# EAGLE schematic ElectronicLoad (EAGLE 9.5.1)
DESIGNER: Ailee Simpson; PART_NUMBER: 68-0015; PROJECT: Electronic Load; REV: 1.0.3

## Sheet 1 of 5
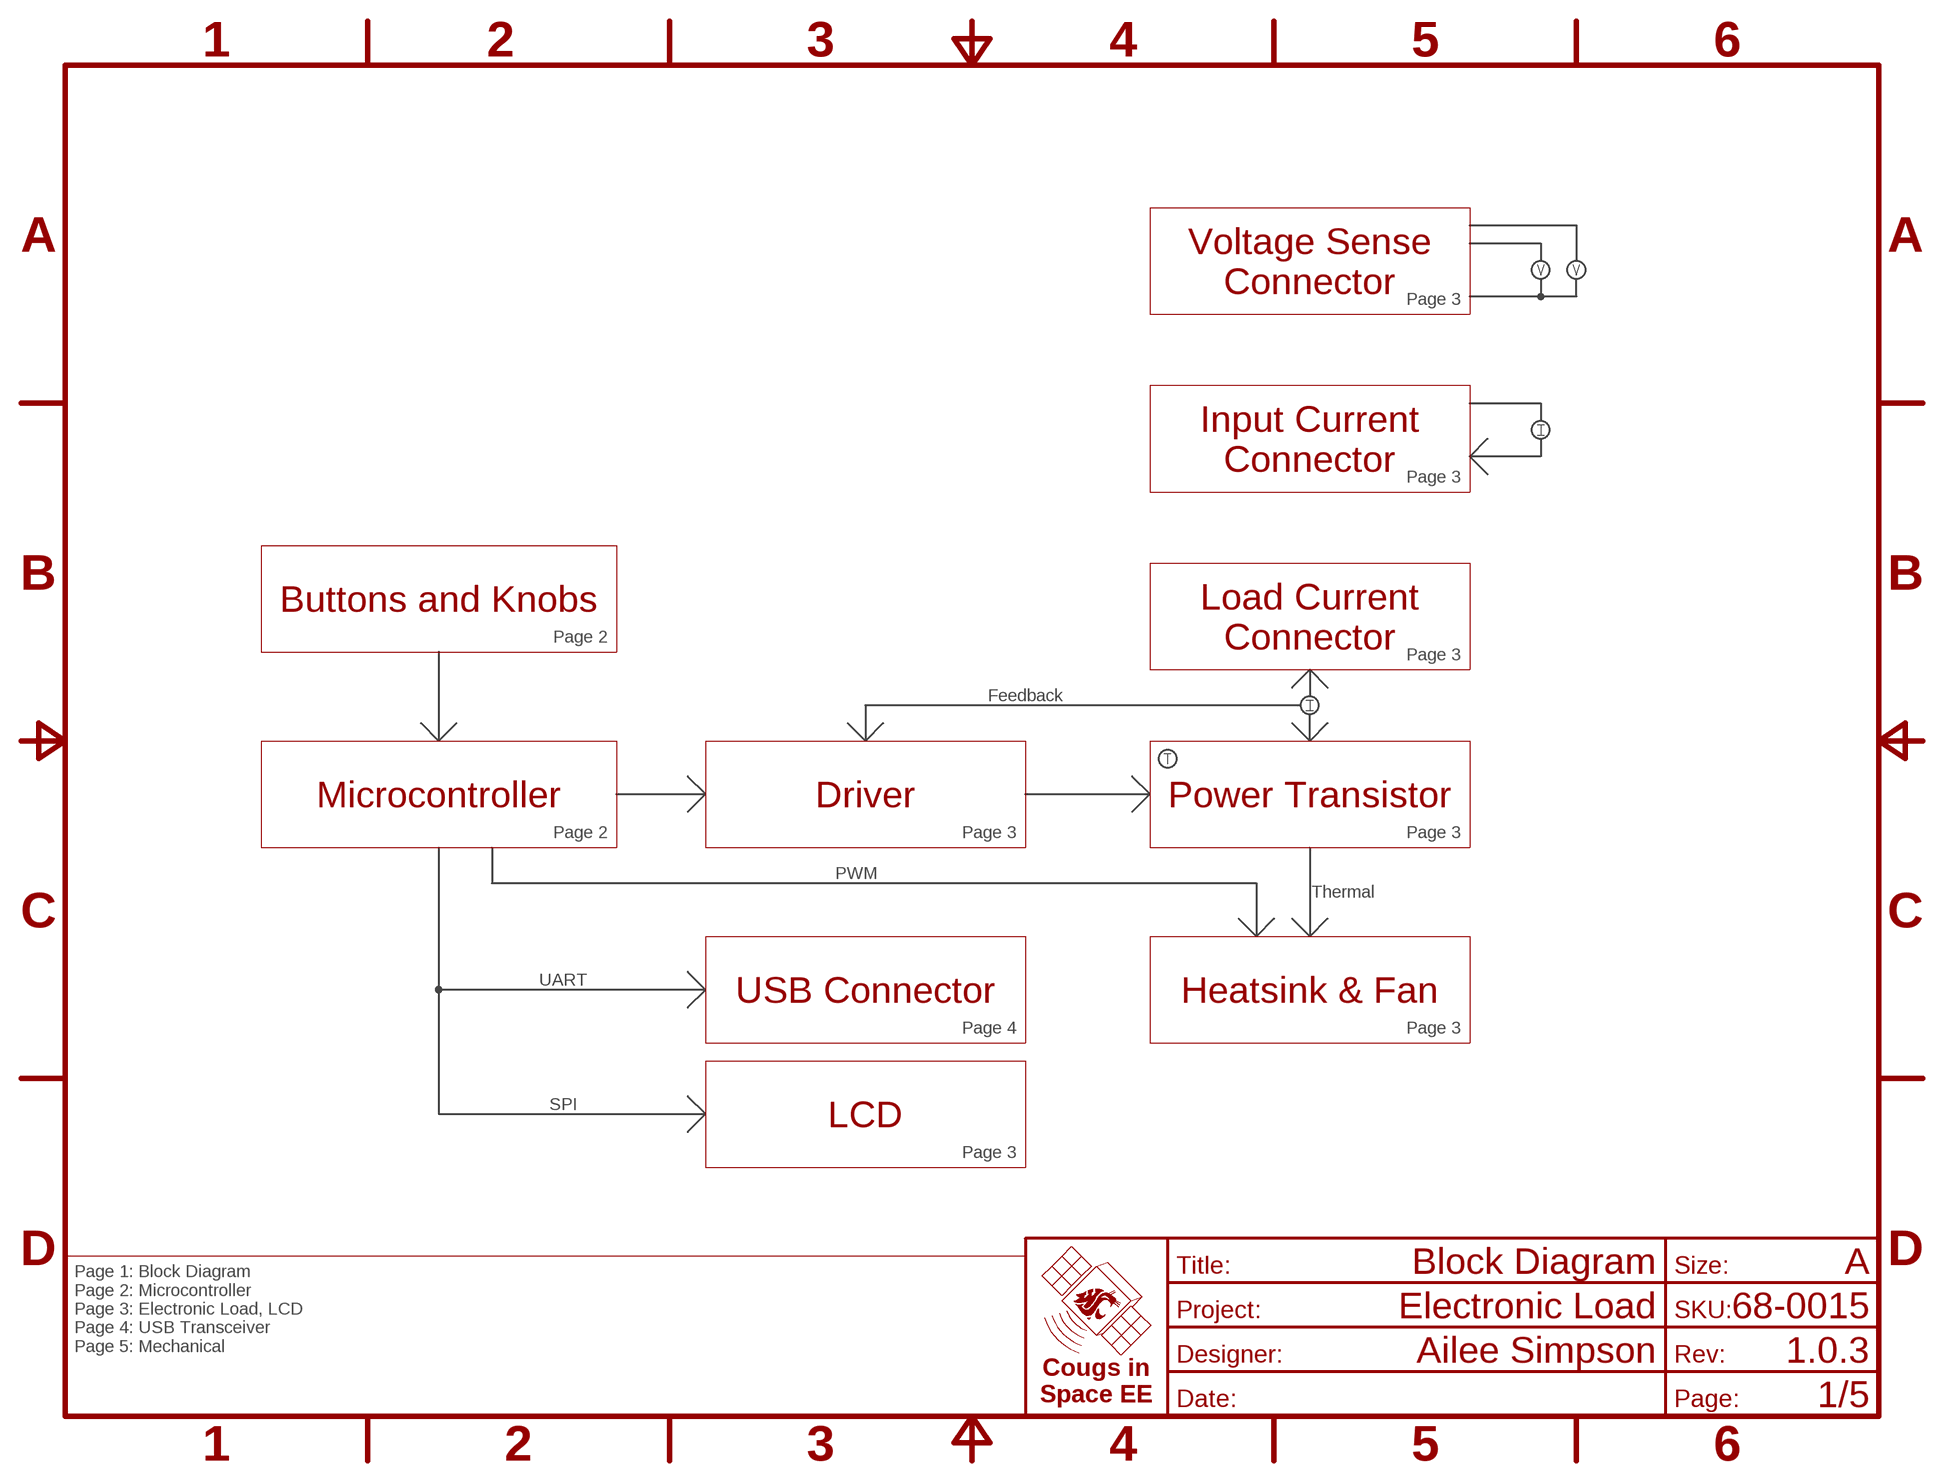
[diagram p0: schematic, sheet 1]
FRAME1 (FRAME-A): TITLE: Block Diagram

### Notes on the sheet
- Voltage Sense
  Connector
- Page 3
- Input Current
  Connector
- Page 3
- Buttons and Knobs
- Load Current
  Connector
- Page 2
- Page 3
- Feedback
- Microcontroller | Driver | Power Transistor
- Page 2 | Page 3 | Page 3
- PWM
- Thermal
- UART | USB Connector | Heatsink & Fan
- Page 4 | Page 3
- SPI | LCD
- Page 3
- Page 1: Block Diagram
  Page 2: Microcontroller
  Page 3: Electronic Load, LCD
  Page 4: USB Transceiver
  Page 5: Mechanical

## Sheet 2 of 5
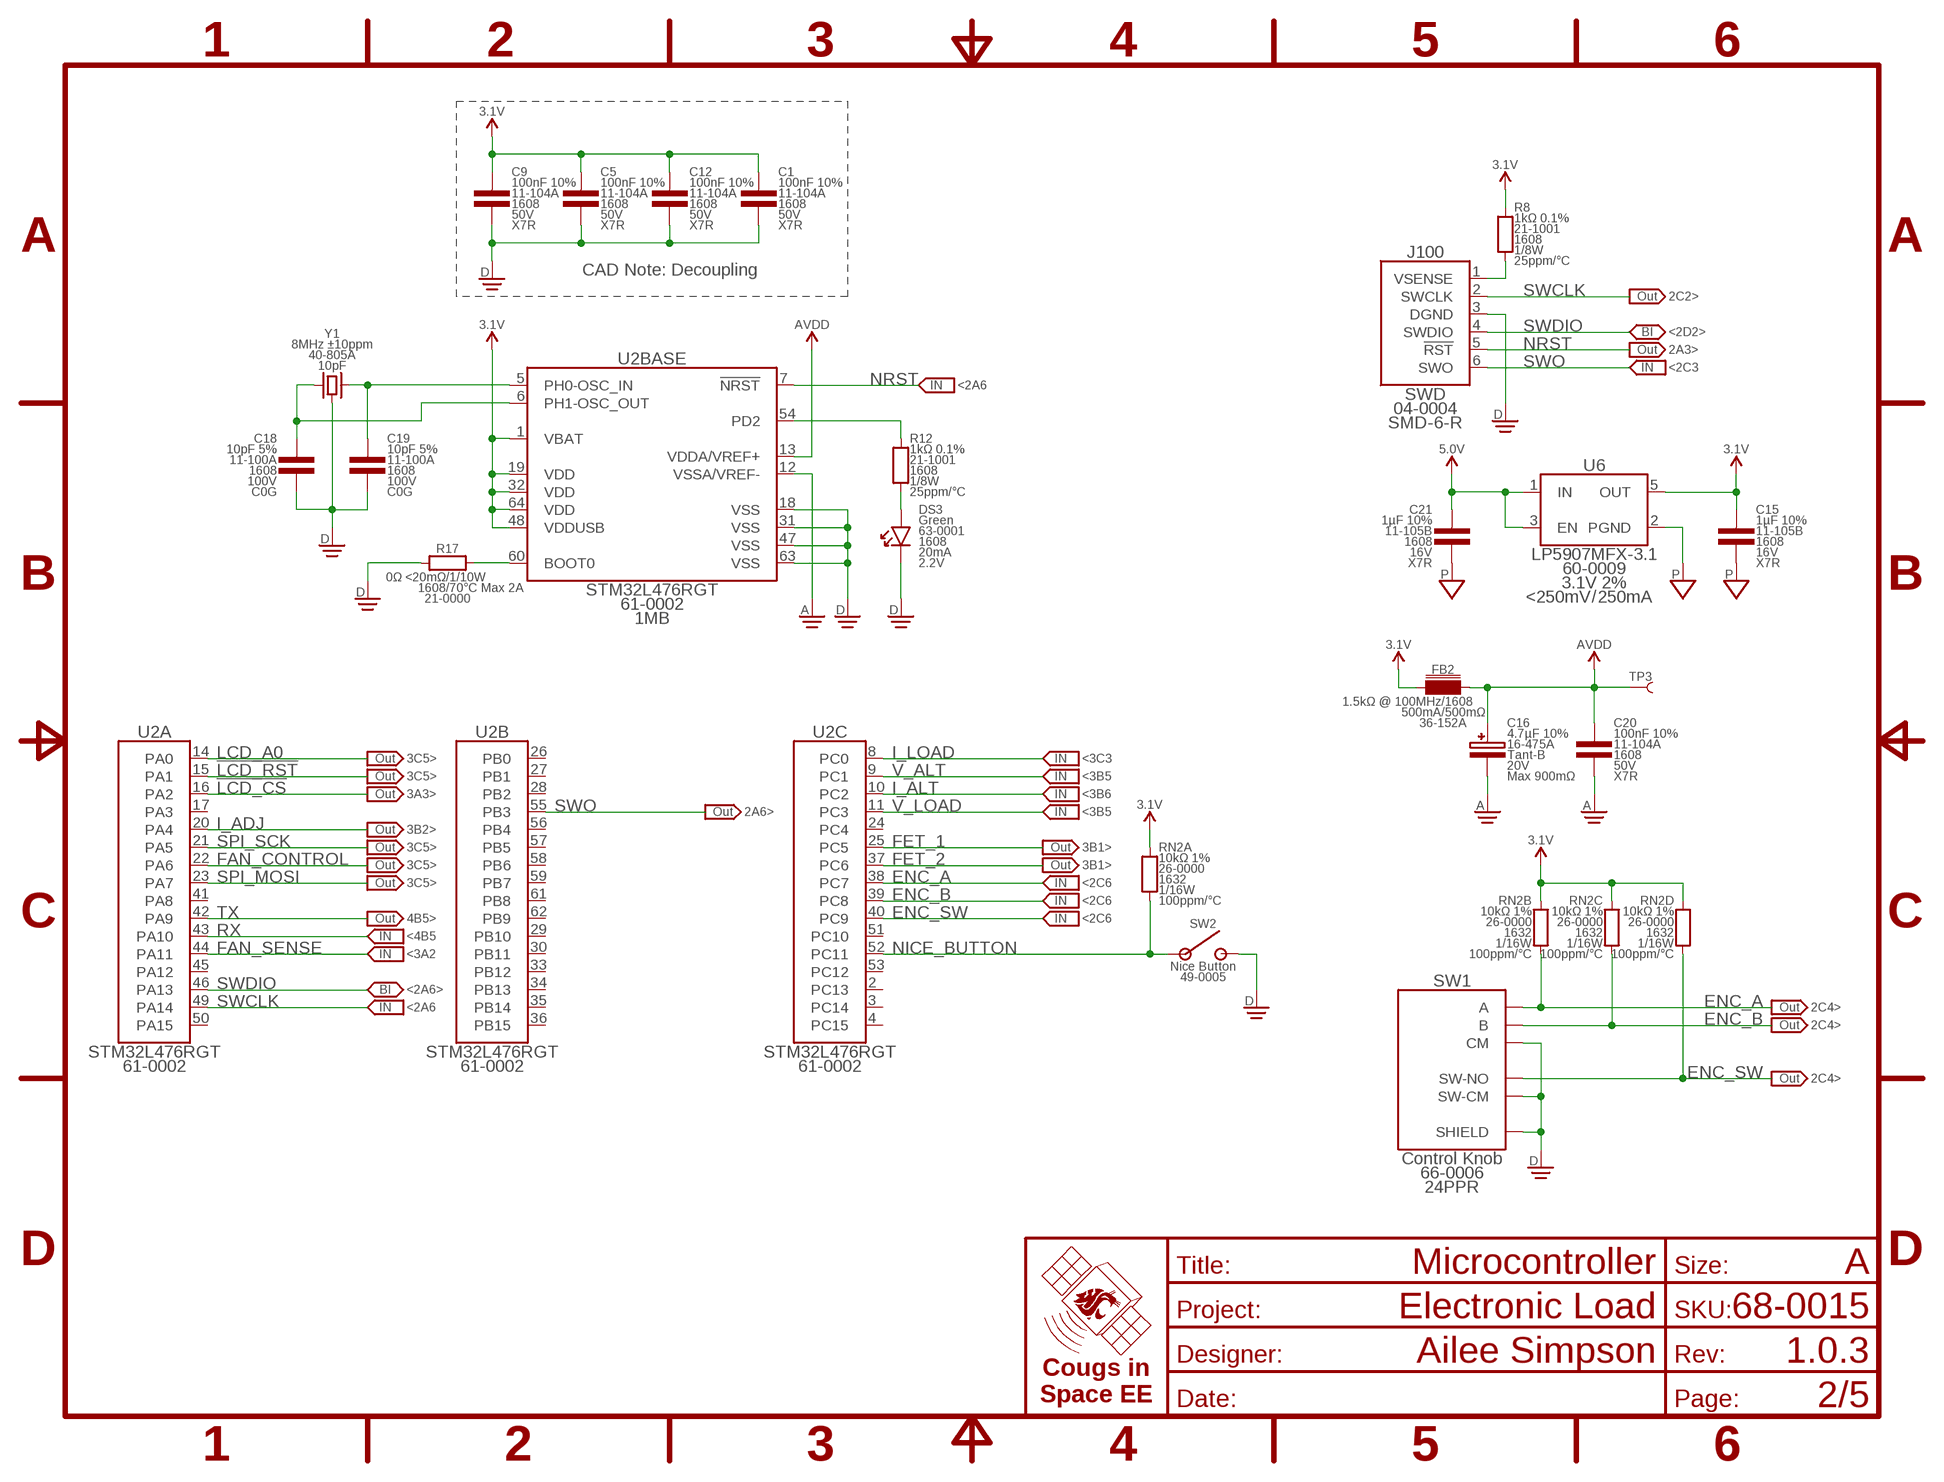
[diagram p1: schematic, sheet 2]
FRAME2 (FRAME-A): TITLE: Microcontroller

### Parts
C1  100nF 10%  CAP-V-100NF-1608  [1608]
C5  100nF 10%  CAP-V-100NF-1608  [1608]
C9  100nF 10%  CAP-V-100NF-1608  [1608]
C12  100nF 10%  CAP-V-100NF-1608  [1608]
C15  1µF 10%  CAP-V-1UF-B-1608  [1608]
C16  4.7µF 10%  CAP-POL-V-4.7UF-4028  [4028-POL]
C18  10pF 5%  CAP-V-10PF-1608  [1608]
C19  10pF 5%  CAP-V-10PF-1608  [1608]
C20  100nF 10%  CAP-V-100NF-1608  [1608]
C21  1µF 10%  CAP-V-1UF-B-1608  [1608]
DS3  Green  LED-V-GRN-1608  [1608-POL]
FB2  1.5kΩ @ 100MHz  CHOKE-H-1.5K-1608  [1608]
J100  SWD  SWDSMD-6-R  [SMD2.54-1X06-R]
R8  1kΩ 0.1%  RES-V-1K-1608  [1608]
R12  1kΩ 0.1%  RES-V-1K-1608  [1608]
R17  0Ω <20mΩ  RES-H-0-1608  [1608]
RN2  10kΩ 1%  RES-4-V-10K-1632  [1632]
SW1  Control Knob  ENCODER-SW-PEC12R-4-S  [PEC12R-4-S]
SW2  Nice Button  SWITCH-SPST-NO-B3F-1050-THT-6060  [THT-6060]
TP3  TEST_POINT-SMD-C-1.25  [SMD-C-1.25]
U2  STM32L476RGT  STM32-64P-L476RGT  [QFP-64-1010]
U6  LP5907MFX-3.1  LDO-3.1-SOT23-5  [SOT23-5]
Y1  8MHz ±10ppm  CRYSTAL-GROUNDED-8M-SMD-5032  [SMD-5032]

### Nets
3.1V: C1.1 C5.1 C9.1 C12.1 C15.1 FB2.1 R8.2 RN2.5 RN2.6 RN2.7 RN2.8 U2.1(BASE:VBAT) U2.19(BASE:VDD) U2.32(BASE:VDD) U2.48(BASE:VDDUSB) U2.64(BASE:VDD) U6.5(OUT) ; also sheet 3,4
5.0V: C21.1 U6.1(IN) U6.3(EN) ; also sheet 3,4
!LCD_CS: U2.16(A:PA2) ; also sheet 3
!LCD_RST: U2.15(A:PA1) ; also sheet 3
AGND: C16.C C20.2 U2.12(BASE:VSSA/VREF-) ; also sheet 4
AVDD: C16.A C20.1 FB2.2 TP3.1 U2.13(BASE:VDDA/VREF+)
BOOT0: R17.2 U2.60(BASE:BOOT0)
DGND: C1.2 C5.2 C9.2 C12.2 C18.2 C19.2 DS3.C J100.3(DGND) R17.1 SW1.1(SW-CM) SW1.C(CM) SW1.SHIELD@1(SHIELD) SW1.SHIELD@2(SHIELD) SW2.3(NO) SW2.4(NO) U2.18(BASE:VSS) U2.31(BASE:VSS) U2.47(BASE:VSS) U2.63(BASE:VSS) Y1.2(GND) Y1.4(GND) ; also sheet 3,4
ENC_A: RN2.2 SW1.A U2.38(C:PC7)
ENC_B: RN2.3 SW1.B U2.39(C:PC8)
ENC_SW: RN2.4 SW1.2(SW-NO) U2.40(C:PC9)
FAN_CONTROL: U2.22(A:PA6) ; also sheet 3
FAN_SENSE: U2.44(A:PA11) ; also sheet 3
FET_1: U2.25(C:PC5) ; also sheet 3
FET_2: U2.37(C:PC6) ; also sheet 3
I_ADJ: U2.20(A:PA4) ; also sheet 3
I_ALT: U2.10(C:PC2) ; also sheet 3
I_LOAD: U2.8(C:PC0) ; also sheet 3
LCD_A0: U2.14(A:PA0) ; also sheet 3
NICE_BUTTON: RN2.1 SW2.1(COM) SW2.2(COM) U2.52(C:PC11)
NRST: J100.5(!RST) U2.7(BASE:!NRST)
OSC_IN: C19.1 U2.5(BASE:PH0-OSC_IN) Y1.3
OSC_OUT: C18.1 U2.6(BASE:PH1-OSC_OUT) Y1.1
PGND: C15.2 C21.2 U6.2(PGND) ; also sheet 3,4
RX: U2.43(A:PA10) ; also sheet 4
SPI_MOSI: U2.23(A:PA7) ; also sheet 3
SPI_SCK: U2.21(A:PA5) ; also sheet 3
SWCLK: J100.2(SWCLK) U2.49(A:PA14)
SWDIO: J100.4(SWDIO) U2.46(A:PA13)
SWO: J100.6(SWO) U2.55(B:PB3)
TO_LED: R12.2 U2.54(BASE:EXTRA_PIN)
TO_LED_ANODE: DS3.A R12.1
TX: U2.42(A:PA9) ; also sheet 4
V_ALT: U2.9(C:PC1) ; also sheet 3
V_LOAD: U2.11(C:PC3) ; also sheet 3
VSENSE: J100.1(VSENSE) R8.1
Unconnected: U2.2(C:PC13) U2.3(C:PC14) U2.4(C:PC15) U2.17(A:PA3) U2.24(C:PC4) U2.26(B:PB0) U2.27(B:PB1) U2.28(B:PB2) U2.29(B:PB10) U2.30(B:PB11) U2.33(B:PB12) U2.34(B:PB13) U2.35(B:PB14) U2.36(B:PB15) U2.41(A:PA8) U2.45(A:PA12) U2.50(A:PA15) U2.51(C:PC10) U2.53(C:PC12) U2.56(B:PB4) U2.57(B:PB5) U2.58(B:PB6) U2.59(B:PB7) U2.61(B:PB8) U2.62(B:PB9)

### Notes on the sheet
- CAD Note: Decoupling
- 2C2>
- <2D2>
- 2A3>
- <2C3
- <2A6
- 3C5> | <3C3
- 3C5> | <3B5
- 3A3> | <3B6
- 2A6> | <3B5
- 3B2>
- 3C5> | 3B1>
- 3C5> | 3B1>
- 3C5> | <2C6
- <2C6
- 4B5> | <2C6
- <4B5
- <3A2
- <2A6>
- <2A6 | 2C4>
- 2C4>
- 2C4>

## Sheet 3 of 5
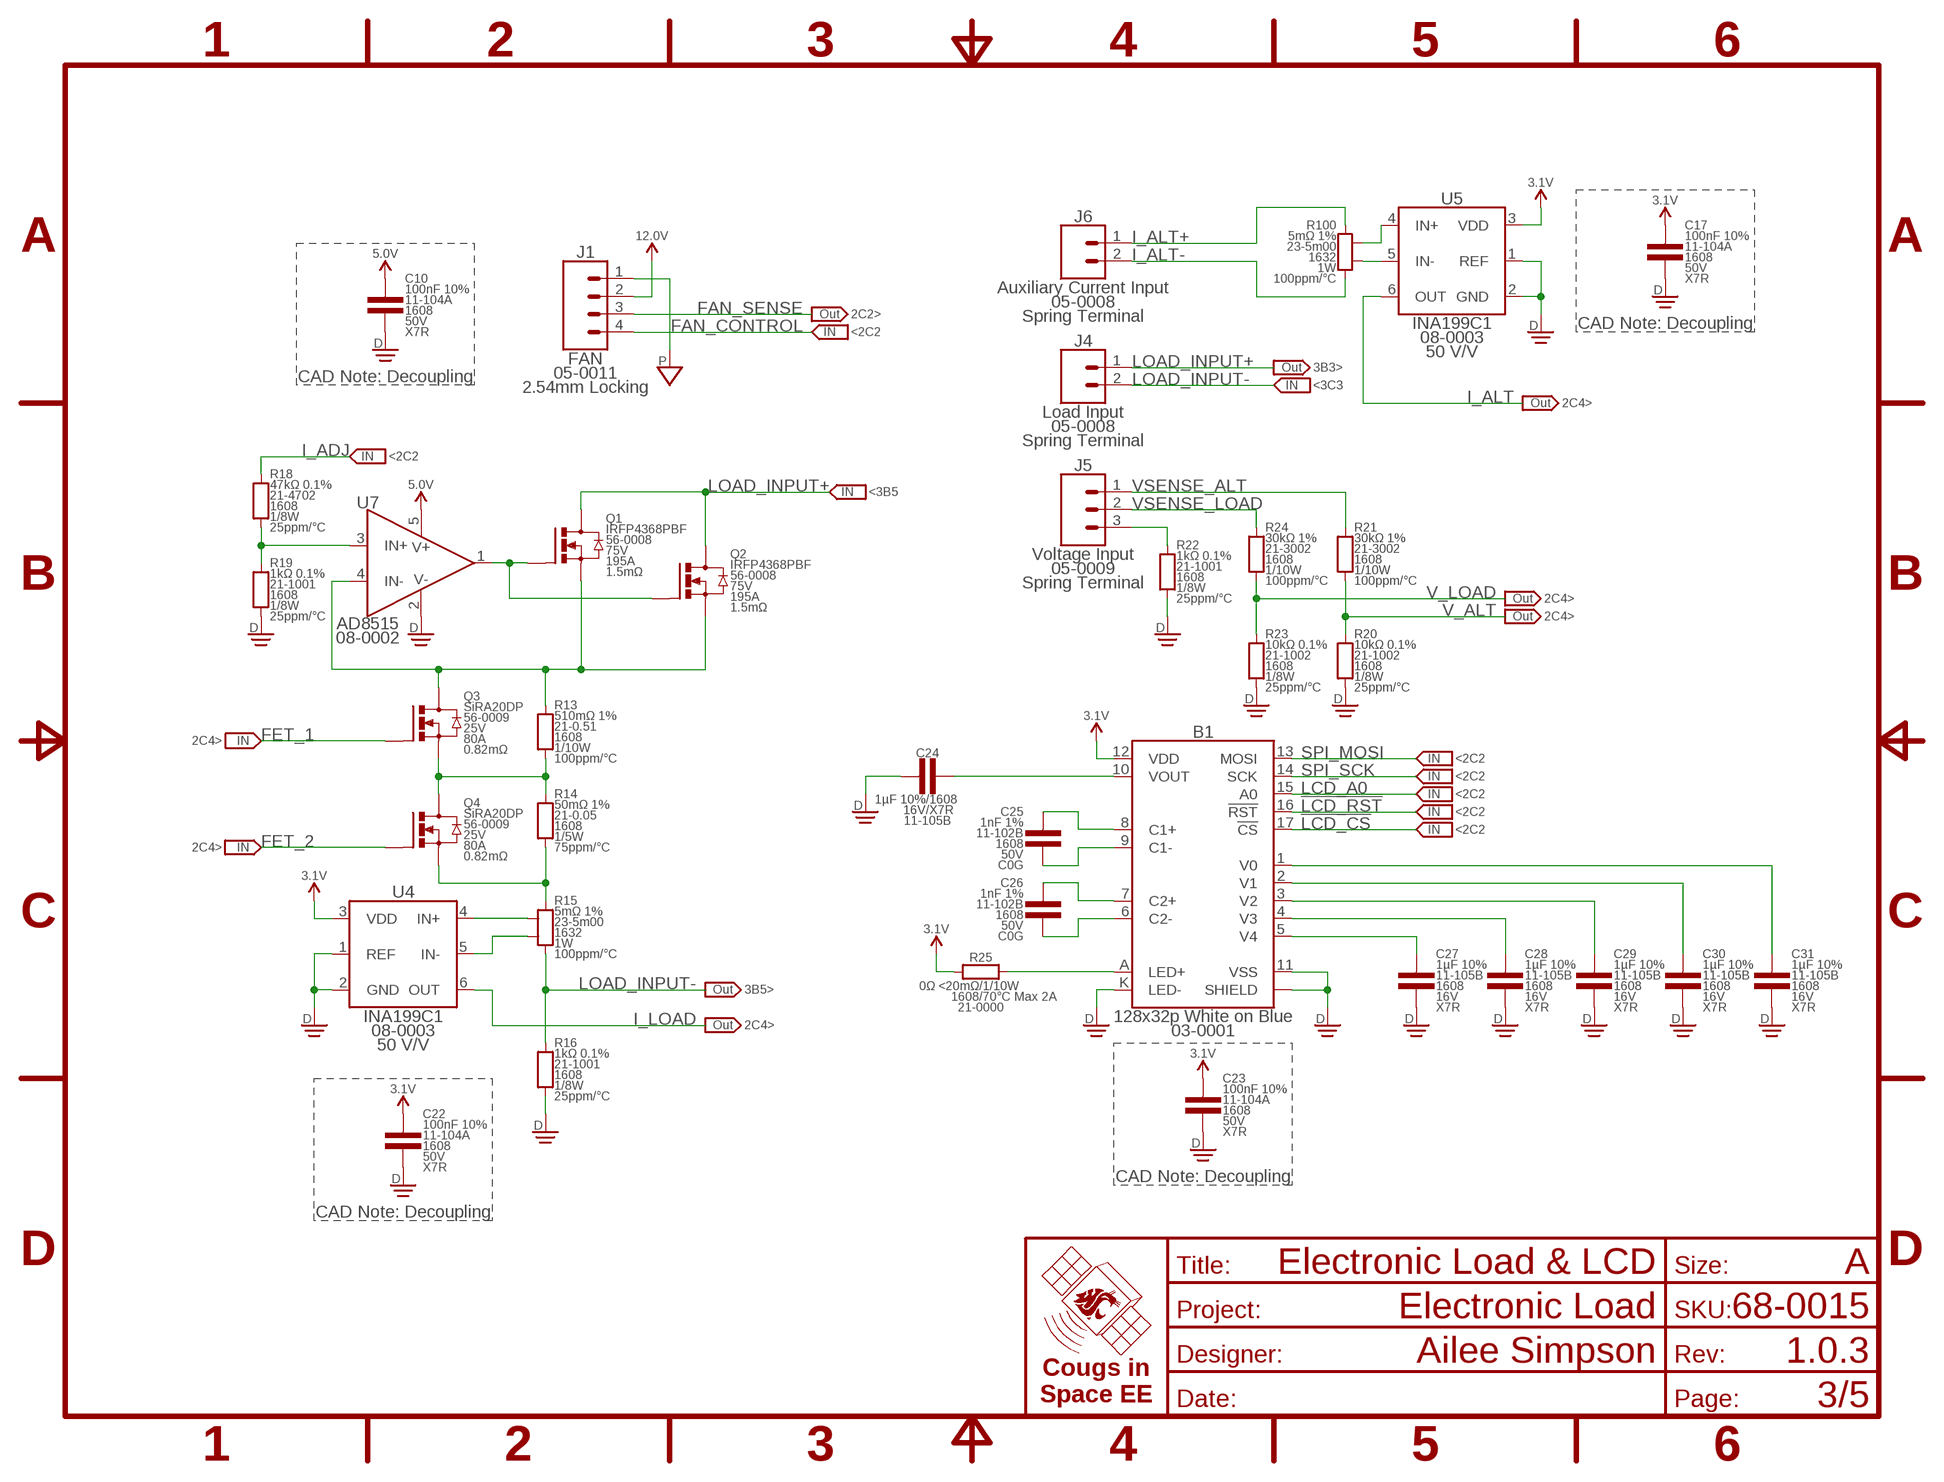
[diagram p2: schematic, sheet 3]
FRAME4 (FRAME-A): TITLE: Electronic Load & LCD

### Parts
B1  128x32p White on Blue  NHD-C12832A11Z-NSW-BBW-3V3  [NHD-C12832A1Z]
C10  100nF 10%  CAP-V-100NF-1608  [1608]
C17  100nF 10%  CAP-V-100NF-1608  [1608]
C22  100nF 10%  CAP-V-100NF-1608  [1608]
C23  100nF 10%  CAP-V-100NF-1608  [1608]
C24  1µF 10%  CAP-H-1UF-B-1608  [1608]
C25  1nF 1%  CAP-V-1NF-B-1608  [1608]
C26  1nF 1%  CAP-V-1NF-B-1608  [1608]
C27  1µF 10%  CAP-V-1UF-B-1608  [1608]
C28  1µF 10%  CAP-V-1UF-B-1608  [1608]
C29  1µF 10%  CAP-V-1UF-B-1608  [1608]
C30  1µF 10%  CAP-V-1UF-B-1608  [1608]
C31  1µF 10%  CAP-V-1UF-B-1608  [1608]
J1  FAN  1X04THT2.54-1X04-LOCK  [THT2.54-1X04-LOCK]
J4  Load Input  1X02-TERMINAL-SPRING-02  [TERMINAL_SPRING-02]
J5  Voltage Input  1X03-TERMINAL-SPRING-3  [TERMINAL_SPRING-03]
J6  Auxiliary Current Input  1X02-TERMINAL-SPRING-02  [TERMINAL_SPRING-02]
Q1  IRFP4368PBF  MOSFET-N-IRFP4368PBF-TO247-3-DOWN  [TO-247-3-DOWN]
Q2  IRFP4368PBF  MOSFET-N-IRFP4368PBF-TO247-3-DOWN  [TO-247-3-DOWN]
Q3  SiRA20DP  MOSFET-N-SIRA20DP-POWERPAK-SO8  [POWERPAK-SO-8]
Q4  SiRA20DP  MOSFET-N-SIRA20DP-POWERPAK-SO8  [POWERPAK-SO-8]
R13  510mΩ 1%  RES-V-0.51R-1608  [1608]
R14  50mΩ 1%  RES-V-0.05R-1608  [1608]
R15  5mΩ 1%  RES-V-KELVIN-0.005R-1632  [1632-KELVIN]
R16  1kΩ 0.1%  RES-V-1K-1608  [1608]
R18  47kΩ 0.1%  RES-V-47K-1608  [1608]
R19  1kΩ 0.1%  RES-V-1K-1608  [1608]
R20  10kΩ 0.1%  RES-V-10K-1608  [1608]
R21  30kΩ 1%  RES-V-30K-1608  [1608]
R22  1kΩ 0.1%  RES-V-1K-1608  [1608]
R23  10kΩ 0.1%  RES-V-10K-1608  [1608]
R24  30kΩ 1%  RES-V-30K-1608  [1608]
R25  0Ω <20mΩ  RES-H-0-1608  [1608]
R100  5mΩ 1%  RES-V-KELVIN-0.005R-1632  [1632-KELVIN]
U4  INA199C1  [SOT363]
U5  INA199C1  [SOT363]
U7  AD8515  OPAMP-1-AD8515  [SOT23-5]

### Nets
3.1V: B1.12(VDD) C17.1 C22.1 C23.1 R25.1 U4.3(VDD) U5.3(VDD) ; also sheet 2,4
5.0V: C10.1 U7.5(V+) ; also sheet 2,4
12.0V: J1.2 ; also sheet 4
!LCD_CS: B1.17(!CS) ; also sheet 2
!LCD_RST: B1.16(!RST) ; also sheet 2
C1+: B1.8(C1+) C25.1
C1-: B1.9(C1-) C25.2
C2+: B1.7(C2+) C26.1
C2-: B1.6(C2-) C26.2
DGND: B1.11(VSS) B1.CHASSIS@1(SHIELD) B1.CHASSIS@2(SHIELD) B1.CHASSIS@3(SHIELD) B1.CHASSIS@4(SHIELD) B1.K(LED-) C10.2 C17.2 C22.2 C23.2 C24.1 C27.2 C28.2 C29.2 C30.2 C31.2 R16.1 R19.1 R20.1 R22.1 R23.1 U4.1(REF) U4.2(GND) U5.1(REF) U5.2(GND) U7.2(V-) ; also sheet 2,4
FAN_CONTROL: J1.4 ; also sheet 2
FAN_SENSE: J1.3 ; also sheet 2
FEEDBACK: Q1.3(S) Q2.3(S) Q3.5(D) Q3.6(D) Q3.7(D) Q3.8(D) Q3.PAD(D) R13.2 U7.4(IN-)
FET_1: Q3.4(G) ; also sheet 2
FET_2: Q4.4(G) ; also sheet 2
FET_GATE: Q1.1(G) Q2.1(G) U7.1(OUT)
I_ADJ: R18.2 ; also sheet 2
I_ALT: U5.6(OUT) ; also sheet 2
I_ALT+: J6.1 R100.2
I_ALT-: J6.2 R100.1
I_LOAD: U4.6(OUT) ; also sheet 2
INPUT_SHUNT+: R100.2-KELVIN U5.4(IN+)
INPUT_SHUNT-: R100.1-KELVIN U5.5(IN-)
LCD_A0: B1.15(A0) ; also sheet 2
LCD_LED: B1.A(LED+) R25.2
LCD_V0: B1.1(V0) C31.1
LCD_V1: B1.2(V1) C30.1
LCD_V2: B1.3(V2) C29.1
LCD_V3: B1.4(V3) C28.1
LCD_V4: B1.5(V4) C27.1
LOAD_INPUT+: J4.1 Q1.2(D) Q1.PAD(D) Q2.2(D) Q2.PAD(D)
LOAD_INPUT-: J4.2 R15.1 R16.2
OP_AMP_IN: R18.1 R19.2 U7.3(IN+)
OUTPUT_SHUNT+: R15.2-KELVIN U4.4(IN+)
OUTPUT_SHUNT-: R15.1-KELVIN U4.5(IN-)
PGND: J1.1 ; also sheet 2,4
SHUNT_LOW: Q4.1(S) Q4.2(S) Q4.3(S) R14.1 R15.2
SHUNT_MID: Q3.1(S) Q3.2(S) Q3.3(S) Q4.5(D) Q4.6(D) Q4.7(D) Q4.8(D) Q4.PAD(D) R13.1 R14.2
SPI_MOSI: B1.13(MOSI) ; also sheet 2
SPI_SCK: B1.14(SCK) ; also sheet 2
V_ALT: R20.2 R21.1 ; also sheet 2
V_LOAD: R23.2 R24.1 ; also sheet 2
VOUT: B1.10(VOUT) C24.2
VSENSE_ALT: J5.1 R21.2
VSENSE_GND: J5.3 R22.2
VSENSE_LOAD: J5.2 R24.2

### Notes on the sheet
- 2C2>
- CAD Note: Decoupling
- <2C2
- 3B3>
- CAD Note: Decoupling
- <3C3
- 2C4>
- <2C2
- <3B5
- 2C4>
- 2C4>
- 2C4>
- <2C2
- <2C2
- <2C2
- <2C2
- <2C2
- 2C4>
- 3B5>
- 2C4>
- CAD Note: Decoupling
- CAD Note: Decoupling

## Sheet 4 of 5
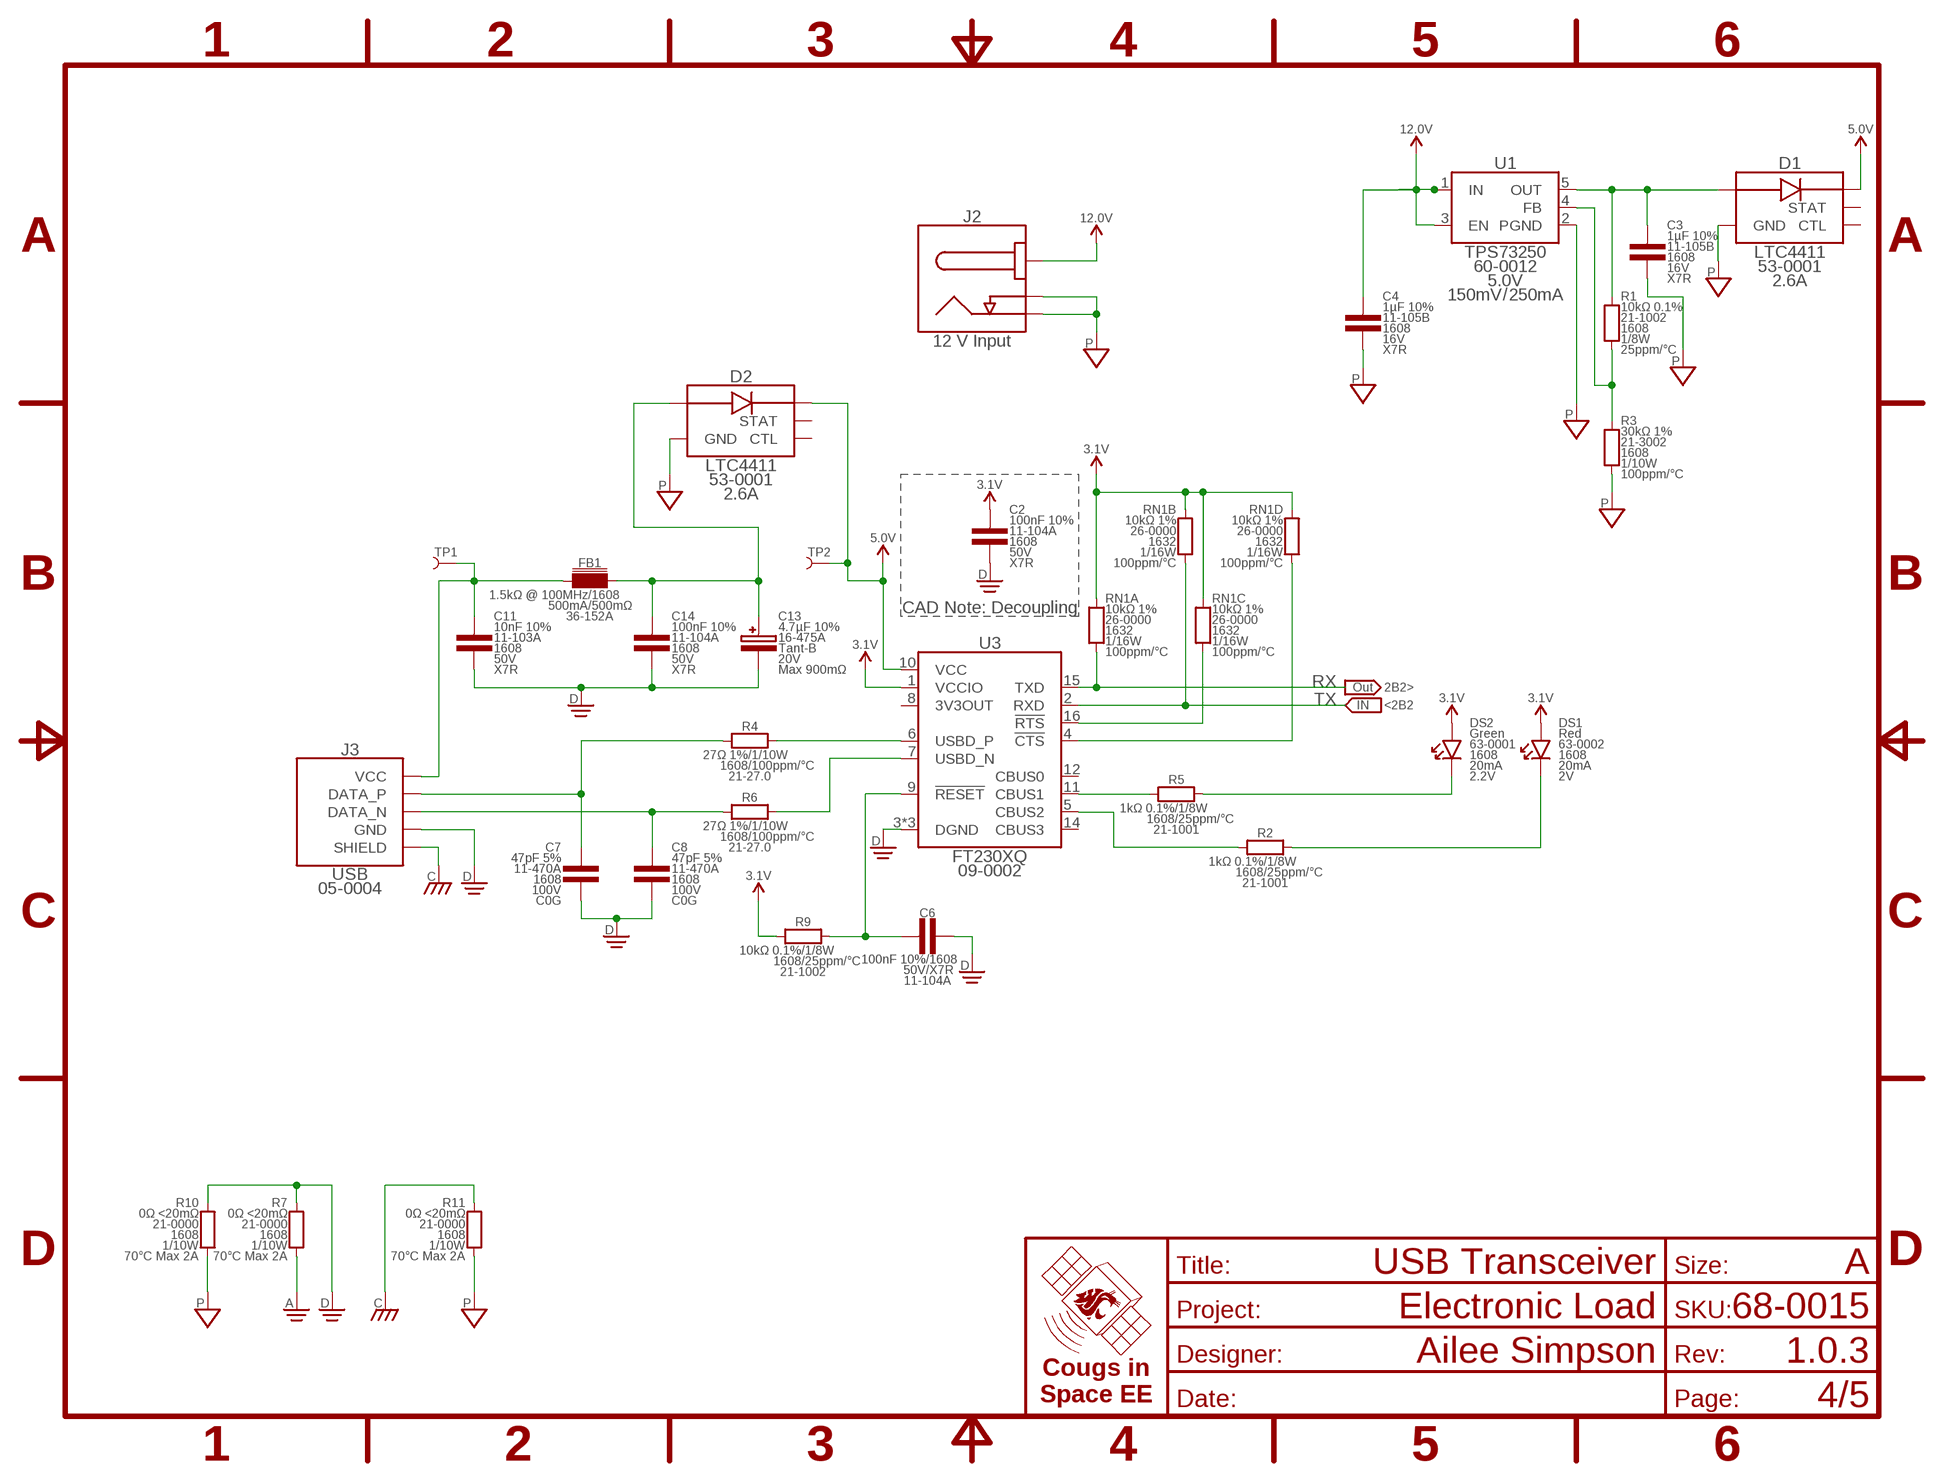
[diagram p3: schematic, sheet 4]
FRAME3 (FRAME-A): TITLE: USB Transceiver

### Parts
C2  100nF 10%  CAP-V-100NF-1608  [1608]
C3  1µF 10%  CAP-V-1UF-B-1608  [1608]
C4  1µF 10%  CAP-V-1UF-B-1608  [1608]
C6  100nF 10%  CAP-H-100NF-1608  [1608]
C7  47pF 5%  CAP-V-47PF-1608  [1608]
C8  47pF 5%  CAP-V-47PF-1608  [1608]
C11  10nF 10%  CAP-V-10NF-1608  [1608]
C13  4.7µF 10%  CAP-POL-V-4.7UF-4028  [4028-POL]
C14  100nF 10%  CAP-V-100NF-1608  [1608]
D1  LTC4411  [SOT23-5]
D2  LTC4411  [SOT23-5]
DS1  Red  LED-V-RED-1608  [1608-POL]
DS2  Green  LED-V-GRN-1608  [1608-POL]
FB1  1.5kΩ @ 100MHz  CHOKE-H-1.5K-1608  [1608]
J2  12 V Input  BARREL-2.1X5.5-R  [BARREL-2.1X5.5-R]
J3  USB  USB-B-FEMALE  [USB-B-FEMALE]
R1  10kΩ 0.1%  RES-V-10K-1608  [1608]
R2  1kΩ 0.1%  RES-H-1K-1608  [1608]
R3  30kΩ 1%  RES-V-30K-1608  [1608]
R4  27Ω 1%  RES-H-27R-1608  [1608]
R5  1kΩ 0.1%  RES-H-1K-1608  [1608]
R6  27Ω 1%  RES-H-27R-1608  [1608]
R7  0Ω <20mΩ  RES-V-0-1608  [1608]
R9  10kΩ 0.1%  RES-H-10K-1608  [1608]
R10  0Ω <20mΩ  RES-V-0-1608  [1608]
R11  0Ω <20mΩ  RES-V-0-1608  [1608]
RN1  10kΩ 1%  RES-4-V-10K-1632  [1632]
TP1  TEST_POINT-THT-1.0  [THT-1.0]
TP2  TEST_POINT-THT-1.0  [THT-1.0]
U1  TPS73250  LDO-FB-5.0-SOT23-5  [SOT23-5]
U3  FT230XQ  FT230X-QFN16  [QFN-16-4040]

### Nets
3.1V: C2.1 DS1.A DS2.A R9.1 RN1.5 RN1.6 RN1.7 RN1.8 U3.1(VCCIO) ; also sheet 2,3
5.0V: D1.5(OUT) D2.5(OUT) TP2.1 U3.10(VCC) ; also sheet 2,3
12.0V: J2.1(CENTER) ; also sheet 3
!CTS: RN1.4 U3.4(!CTS)
!RTS: RN1.3 U3.16(!RTS)
AGND: R7.1 ; also sheet 2
CBUS1: R5.1 U3.11(CBUS1)
CBUS2: R2.1 U3.5(CBUS2)
CHASSIS: J3.SHIELD@1(SHIELD) J3.SHIELD@2(SHIELD) R11.2 ; also sheet 5
DGND: C2.2 C6.2 C7.2 C8.2 C11.2 C13.C C14.2 J3.4(GND) R7.2 R10.2 U3.3(DGND) U3.13(DGND) U3.PAD(DGND) ; also sheet 2,3
N$2: C4.1 U1.1(IN) U1.3(EN) ; supply symbol labelled 12.0V
N$3: C13.A C14.1 D2.1(IN) FB1.2
N$4: C3.1 D1.1(IN) R1.2 U1.5(OUT)
N$7: R1.1 R3.2 U1.4(FB)
PGND: C3.2 C4.2 D1.2(GND) D2.2(GND) J2.2(SLEEVE) J2.3(SW) R3.1 R10.1 R11.1 U1.2(PGND) ; also sheet 2,3
RX: RN1.1 U3.15(TXD) ; also sheet 2
RXLED_C: DS1.C R2.2
TX: RN1.2 U3.2(RXD) ; also sheet 2
TXLED_C: DS2.C R5.2
USB5V: C11.1 FB1.1 J3.1(VCC) TP1.1
USB_CONN_N: C8.1 J3.2(DATA_N) R6.1
USB_CONN_P: C7.1 J3.3(DATA_P) R4.1
USB_N: R6.2 U3.7(USBD_N)
USB_P: R4.2 U3.6(USBD_P)
USB_RESET: C6.1 R9.2 U3.9(!RESET)
Unconnected: D1.3(CTL) D1.4(STAT) D2.3(CTL) D2.4(STAT) U3.8(3V3OUT) U3.12(CBUS0) U3.14(CBUS3)

### Notes on the sheet
- CAD Note: Decoupling
- 2B2>
- <2B2

## Sheet 5 of 5
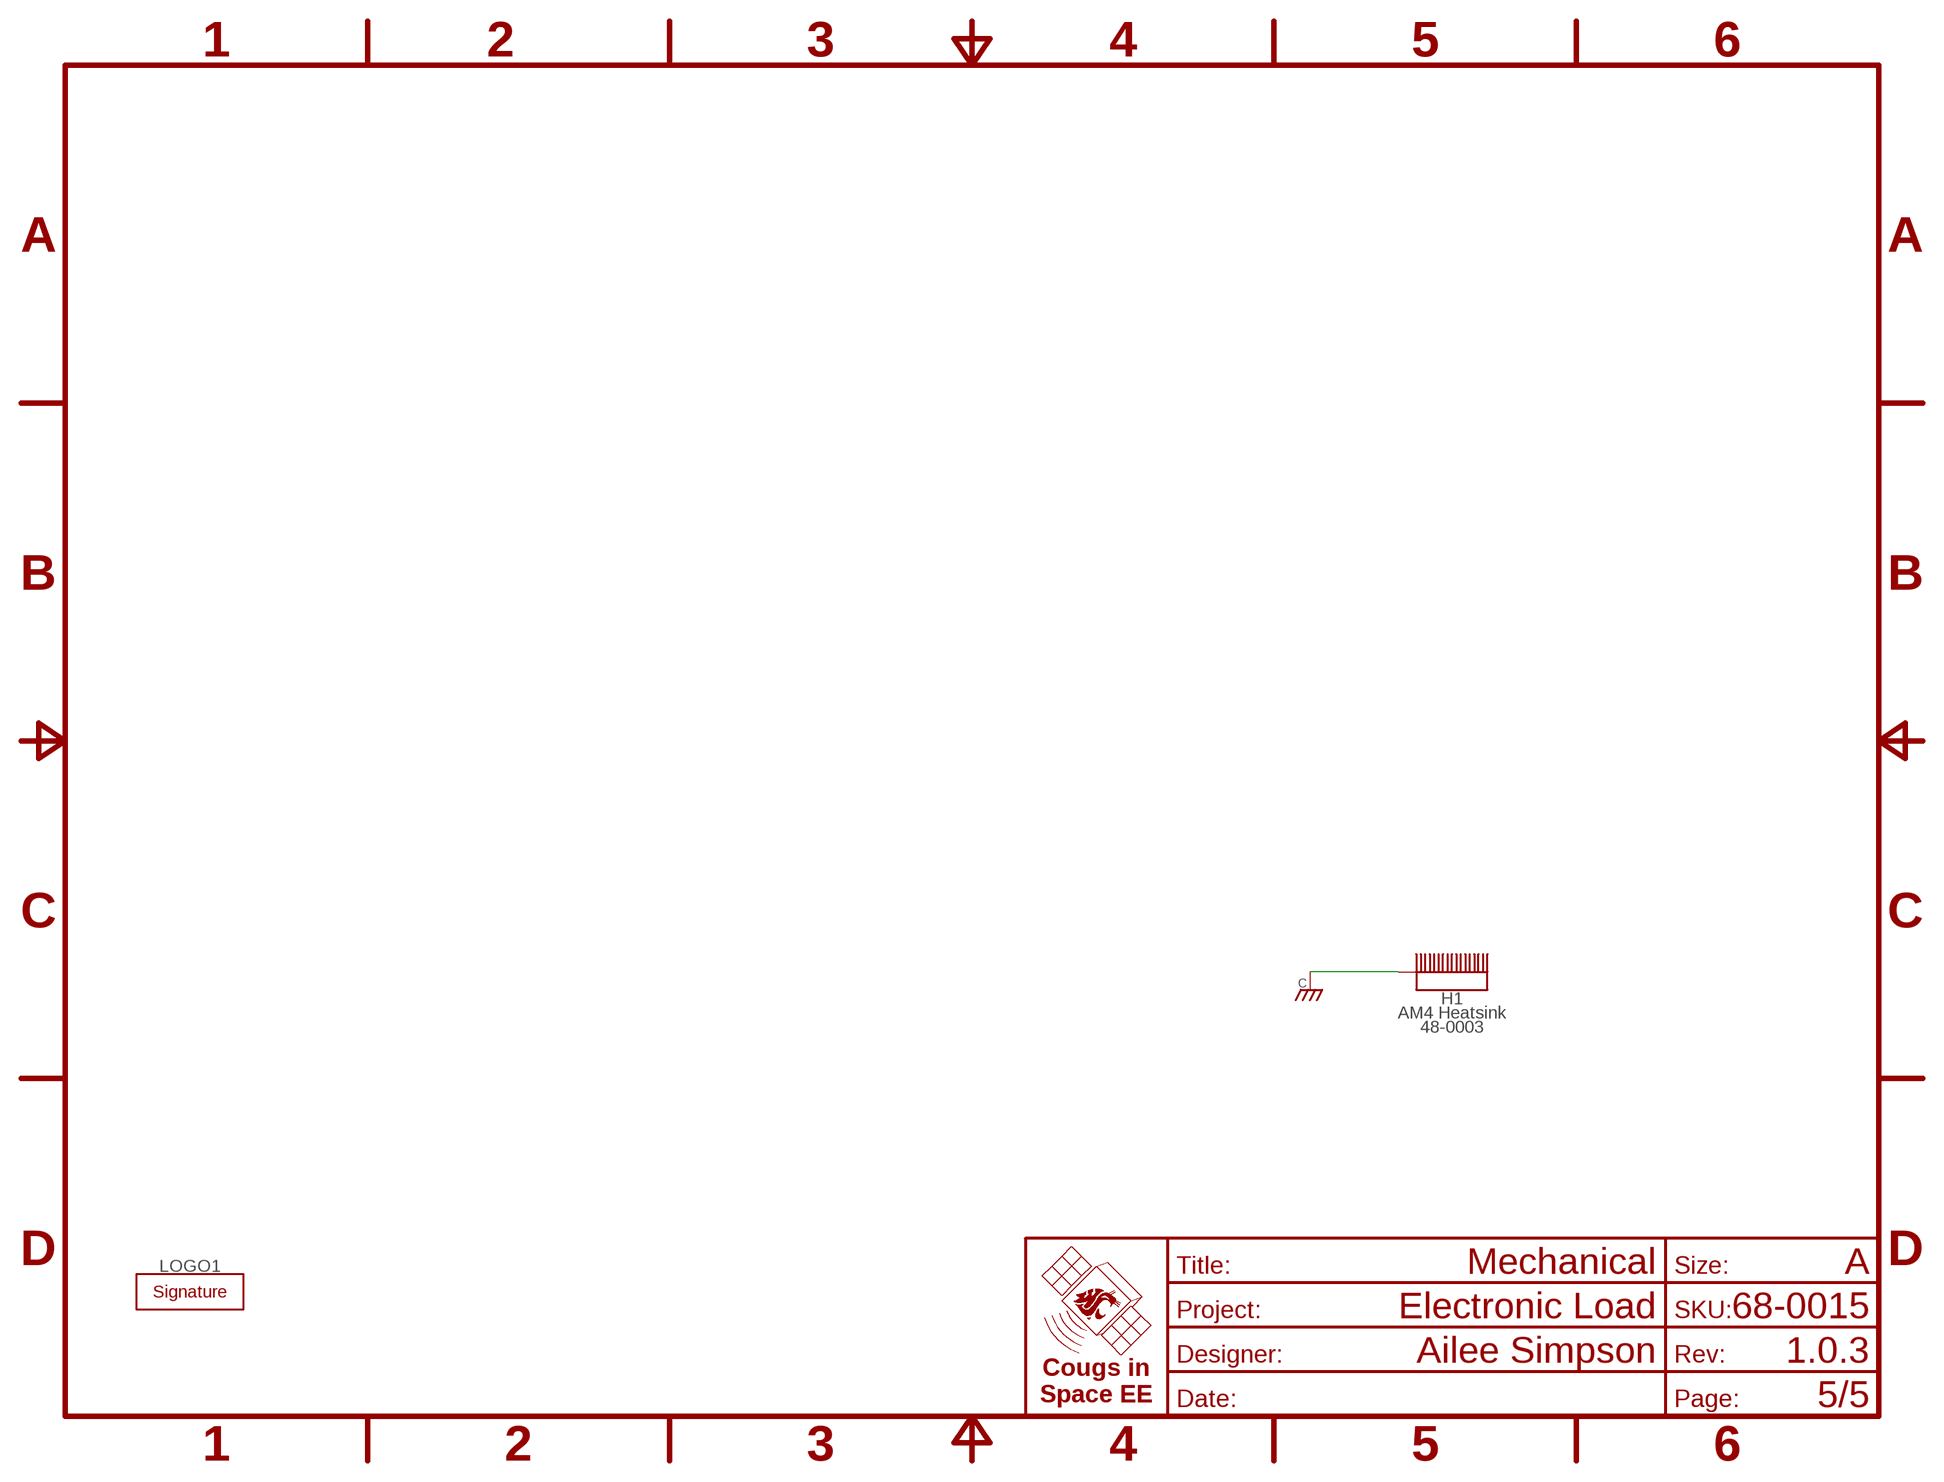
[diagram p4: schematic, sheet 5]
FRAME5 (FRAME-A): TITLE: Mechanical

### Parts
H1  AM4 Heatsink  HEATSINK-AM4  [HEATSINK-AM4]
LOGO1  SIGNATUREJAYSON  [SIGN-JAYSON]

### Nets
CHASSIS: H1.1(CHASSIS) H1.2(CHASSIS) H1.3(CHASSIS) H1.4(CHASSIS) H1.V1(CHASSIS) H1.V2(CHASSIS) H1.V3(CHASSIS) H1.V4(CHASSIS) H1.V5(CHASSIS) H1.V6(CHASSIS) H1.V7(CHASSIS) H1.V8(CHASSIS) H1.V9(CHASSIS) H1.V10(CHASSIS) H1.V11(CHASSIS) H1.V12(CHASSIS) H1.V13(CHASSIS) H1.V14(CHASSIS) H1.V15(CHASSIS) H1.V16(CHASSIS) H1.V17(CHASSIS) H1.V18(CHASSIS) H1.V19(CHASSIS) H1.V20(CHASSIS) H1.V21(CHASSIS) H1.V22(CHASSIS) H1.V23(CHASSIS) H1.V24(CHASSIS) H1.V25(CHASSIS) H1.V26(CHASSIS) H1.V27(CHASSIS) H1.V28(CHASSIS) H1.V29(CHASSIS) H1.V30(CHASSIS) H1.V31(CHASSIS) H1.V32(CHASSIS) H1.V33(CHASSIS) H1.V34(CHASSIS) H1.V35(CHASSIS) H1.V36(CHASSIS) H1.V37(CHASSIS) H1.V38(CHASSIS) H1.V39(CHASSIS) H1.V40(CHASSIS) H1.V41(CHASSIS) H1.V42(CHASSIS) H1.V43(CHASSIS) H1.V44(CHASSIS) H1.V45(CHASSIS) H1.V46(CHASSIS) H1.V47(CHASSIS) H1.V48(CHASSIS) H1.V49(CHASSIS) H1.V50(CHASSIS) H1.V51(CHASSIS) H1.V52(CHASSIS) H1.V53(CHASSIS) H1.V54(CHASSIS) H1.V55(CHASSIS) H1.V56(CHASSIS) H1.V57(CHASSIS) H1.V58(CHASSIS) H1.V59(CHASSIS) H1.V60(CHASSIS) H1.V61(CHASSIS) H1.V62(CHASSIS) H1.V63(CHASSIS) H1.V64(CHASSIS) H1.V65(CHASSIS) H1.V66(CHASSIS) H1.V67(CHASSIS) H1.V68(CHASSIS) H1.V69(CHASSIS) H1.V70(CHASSIS) H1.V71(CHASSIS) H1.V72(CHASSIS) ; also sheet 4

## Library data of the parts
B1 = CougsInSpace-Boards:NHD-C12832A11Z: LCD Module - NHD-C12832A11Z; SKU: 03-0001
C1 C2 C5 C9 C10 C12 C14 C17 C20 C22 C23 = CougsInSpace-Capacitors:CAP-V: Capacitor - Vertical Orientation; PACKAGE: 1608; SKU: 11-104A; TEMP: X7R; VOLTAGE: 50V
C3 C4 C15 C21 C27-C31 = CougsInSpace-Capacitors:CAP-V: Capacitor - Vertical Orientation; PACKAGE: 1608; SKU: 11-105B; TEMP: X7R; VOLTAGE: 16V
C6 = CougsInSpace-Capacitors:CAP-H: Capacitor - Horizontal Orientation; PACKAGE: 1608; SKU: 11-104A; TEMP: X7R; VOLTAGE: 50V
C7 C8 = CougsInSpace-Capacitors:CAP-V: Capacitor - Vertical Orientation; PACKAGE: 1608; SKU: 11-470A; TEMP: C0G; VOLTAGE: 100V
C11 = CougsInSpace-Capacitors:CAP-V: Capacitor - Vertical Orientation; PACKAGE: 1608; SKU: 11-103A; TEMP: X7R; VOLTAGE: 50V
C13 C16 = CougsInSpace-Capacitors:CAP-POL-V: Capacitor Polarized - Vertical Orientation; ESR: Max 900mΩ; PACKAGE: Tant-B; SKU: 16-475A; VOLTAGE: 20V
C18 C19 = CougsInSpace-Capacitors:CAP-V: Capacitor - Vertical Orientation; PACKAGE: 1608; SKU: 11-100A; TEMP: C0G; VOLTAGE: 100V
C24 = CougsInSpace-Capacitors:CAP-H: Capacitor - Horizontal Orientation; PACKAGE: 1608; SKU: 11-105B; TEMP: X7R; VOLTAGE: 16V
C25 C26 = CougsInSpace-Capacitors:CAP-V: Capacitor - Vertical Orientation; PACKAGE: 1608; SKU: 11-102B; TEMP: C0G; VOLTAGE: 50V
D1 D2 = CougsInSpace-DiscreteSemi:LTC4411: LTC4411 Ideal diode (transistor acting as a diode); CURRENT: 2.6A; SKU: 53-0001
DS1 = CougsInSpace-LEDs:LED-V: LED Vertical; CURRENT: 20mA; PACKAGE: 1608; SKU: 63-0002; VF: 2V
DS2 DS3 = CougsInSpace-LEDs:LED-V: LED Vertical; CURRENT: 20mA; PACKAGE: 1608; SKU: 63-0001; VF: 2.2V
FB1 FB2 = CougsInSpace-Coils:CHOKE-H: Choke (Ferrite Bead) Horizontal; CURRENT: 500mA; DCR: 500mΩ; PACKAGE: 1608; SKU: 36-152A
H1 = CougsInSpace-Hardware:HEATSINK: Heatsink; SKU: 48-0003
J1 = CougsInSpace-Connectors:1X04: Generic Connector - 4 Conductor; PACKAGE: 2.54mm Locking; SKU: 05-0011
J2 = CougsInSpace-Connectors:BARREL: Barrel Connector Normal closed switch; SKU: 05-0005
J3 = CougsInSpace-Connectors:USB: USB 1.0/2.0; SKU: 05-0004
J4 J6 = CougsInSpace-Connectors:1X02: Generic Connector - 2 Conductor; PACKAGE: Spring Terminal; SKU: 05-0008; VALUE: [Override]
J5 = CougsInSpace-Connectors:1X03: Generic Connector - 3 Conductor; PACKAGE: Spring Terminal; SKU: 05-0009; VALUE: [Override]
J100 = CougsInSpace-Connectors:SWD: Serial Wire Debug; PACKAGE: SMD-6-R; SKU: 04-0004
LOGO1 = CougsInSpace-Aesthetics:SIGNATURE: Designer's (Artist's) Signature
Q1 Q2 = CougsInSpace-DiscreteSemi:MOSFET-N: N-Channel MOSFET; CURRENT: 195A; RDS: 1.5mΩ; SKU: 56-0008; VDS: 75V
Q3 Q4 = CougsInSpace-DiscreteSemi:MOSFET-N: N-Channel MOSFET; CURRENT: 80A; RDS: 0.82mΩ; SKU: 56-0009; VDS: 25V
R1 R20 R23 = CougsInSpace-Resistors:RES-V: Resistor Vertical; PACKAGE: 1608; POWER: 1/8W; SKU: 21-1002; TEMP: 25ppm/°C
R2 R5 = CougsInSpace-Resistors:RES-H: Resistor Horizontal; PACKAGE: 1608; POWER: 1/8W; SKU: 21-1001; TEMP: 25ppm/°C
R3 R21 R24 = CougsInSpace-Resistors:RES-V: Resistor Vertical; PACKAGE: 1608; POWER: 1/10W; SKU: 21-3002; TEMP: 100ppm/°C
R4 R6 = CougsInSpace-Resistors:RES-H: Resistor Horizontal; PACKAGE: 1608; POWER: 1/10W; SKU: 21-27.0; TEMP: 100ppm/°C
R7 R10 R11 = CougsInSpace-Resistors:RES-V: Resistor Vertical; PACKAGE: 1608; POWER: 1/10W; SKU: 21-0000; TEMP: 70°C Max 2A
R8 R12 R16 R19 R22 = CougsInSpace-Resistors:RES-V: Resistor Vertical; PACKAGE: 1608; POWER: 1/8W; SKU: 21-1001; TEMP: 25ppm/°C
R9 = CougsInSpace-Resistors:RES-H: Resistor Horizontal; PACKAGE: 1608; POWER: 1/8W; SKU: 21-1002; TEMP: 25ppm/°C
R13 = CougsInSpace-Resistors:RES-V: Resistor Vertical; PACKAGE: 1608; POWER: 1/10W; SKU: 21-0.51; TEMP: 100ppm/°C
R14 = CougsInSpace-Resistors:RES-V: Resistor Vertical; PACKAGE: 1608; POWER: 1/5W; SKU: 21-0.05; TEMP: 75ppm/°C
R15 R100 = CougsInSpace-Resistors:RES-V-KELVIN: Resistor Vertical - Kelvin Connection; PACKAGE: 1632; POWER: 1W; SKU: 23-5m00; TEMP: 100ppm/°C
R17 R25 = CougsInSpace-Resistors:RES-H: Resistor Horizontal; PACKAGE: 1608; POWER: 1/10W; SKU: 21-0000; TEMP: 70°C Max 2A
R18 = CougsInSpace-Resistors:RES-V: Resistor Vertical; PACKAGE: 1608; POWER: 1/8W; SKU: 21-4702; TEMP: 25ppm/°C
RN1 RN2 = CougsInSpace-Resistors:RES-4-V: Resistor Array - 4 - Vertical; PACKAGE: 1632; POWER: 1/16W; SKU: 26-0000; TEMP: 100ppm/°C
SW1 = CougsInSpace-Sensors:ENCODER-SW: Quadrature Encoder - Integrated Switch; COUNTS: 24PPR; SKU: 66-0006; VALUE: [Override]
SW2 = CougsInSpace-Switches:SWITCH-SPST-NO: Single Pole Single Throw (SPST) B3U-1000P <https://github.com/CougsInSpace/Resources/blob/master/SupplierDocuments/OMRON/TactileSwitch_SMD.pdf>; SKU: 49-0005; VALUE: [Override]
TP1-TP3 = CougsInSpace-Connectors:TEST_POINT: Test Point Used to probe points in a circuit for debugging or general measurement
U1 = CougsInSpace-IC-Power:LDO-FB: Low Dropout Linear Regulator - with Feedback; IMAX: 250mA; SKU: 60-0012; VDO: 150mV; VOUT: 5.0V
U2 = CougsInSpace-IC-µController:STM32-64P-?*: STM 32b µController - 64 Pin STM32L476Rx <https://github.com/CougsInSpace/Resources/blob/master/SupplierDocuments/ST/STM32L476.pdf> STM32L496Rx <https://github.com/CougsInSpace/Resources/blob/master/SupplierDocuments/ST/STM32L496.pdf>; EXTRAPIN: PD2; FLASH: 1MB; SKU: 61-0002
U3 = CougsInSpace-IC-Comms:FT230X: FT230x USB/UART Bridge FT230x <https://github.com/CougsInSpace/Resources/blob/master/SupplierDocuments/FTDI/FT230X_USB-UARTBridge.pdf>; SKU: 09-0002
U4 U5 = CougsInSpace-IC-Amplifiers:INA199: INA199 Current-sense amplifier; GAIN: 50 V/V; SKU: 08-0003
U6 = CougsInSpace-IC-Power:LDO: Low Dropout Linear Regulator; IMAX: 250mA; SKU: 60-0009; VDO: <250mV; VOUT: 3.1V 2%
U7 = CougsInSpace-IC-Amplifiers:OPAMP-1: Operational Amplifier - Single; SKU: 08-0002
Y1 = CougsInSpace-Clocks:CRYSTAL-GROUNDED: Crystal Grounded; LOADCAP: 10pF; SKU: 40-805A